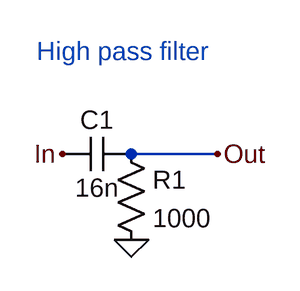
[diagram p0: schematic hpassFilter.asc]
hpassFilter.asc, the LTspice schematic file:
Version 4
SHEET 1 880 680
WIRE 240 144 160 144
FLAG 160 224 0
FLAG 96 144 In
FLAG 240 144 Out
SYMBOL cap 160 128 R90
WINDOW 0 0 32 VBottom 2
WINDOW 3 32 32 VTop 2
SYMATTR InstName C1
SYMATTR Value 16n
SYMBOL res 144 128 R0
SYMATTR InstName R1
SYMATTR Value 1000
TEXT 72 48 Left 2 ;High pass filter

The netlist it stands for:
* hpassFilter.asc
C1 Out In 16n
R1 Out 0 1000
* High pass filter
.backanno
.end